# EAGLE design ArmazConnect - Rev B4 (EAGLE 7.7.0)
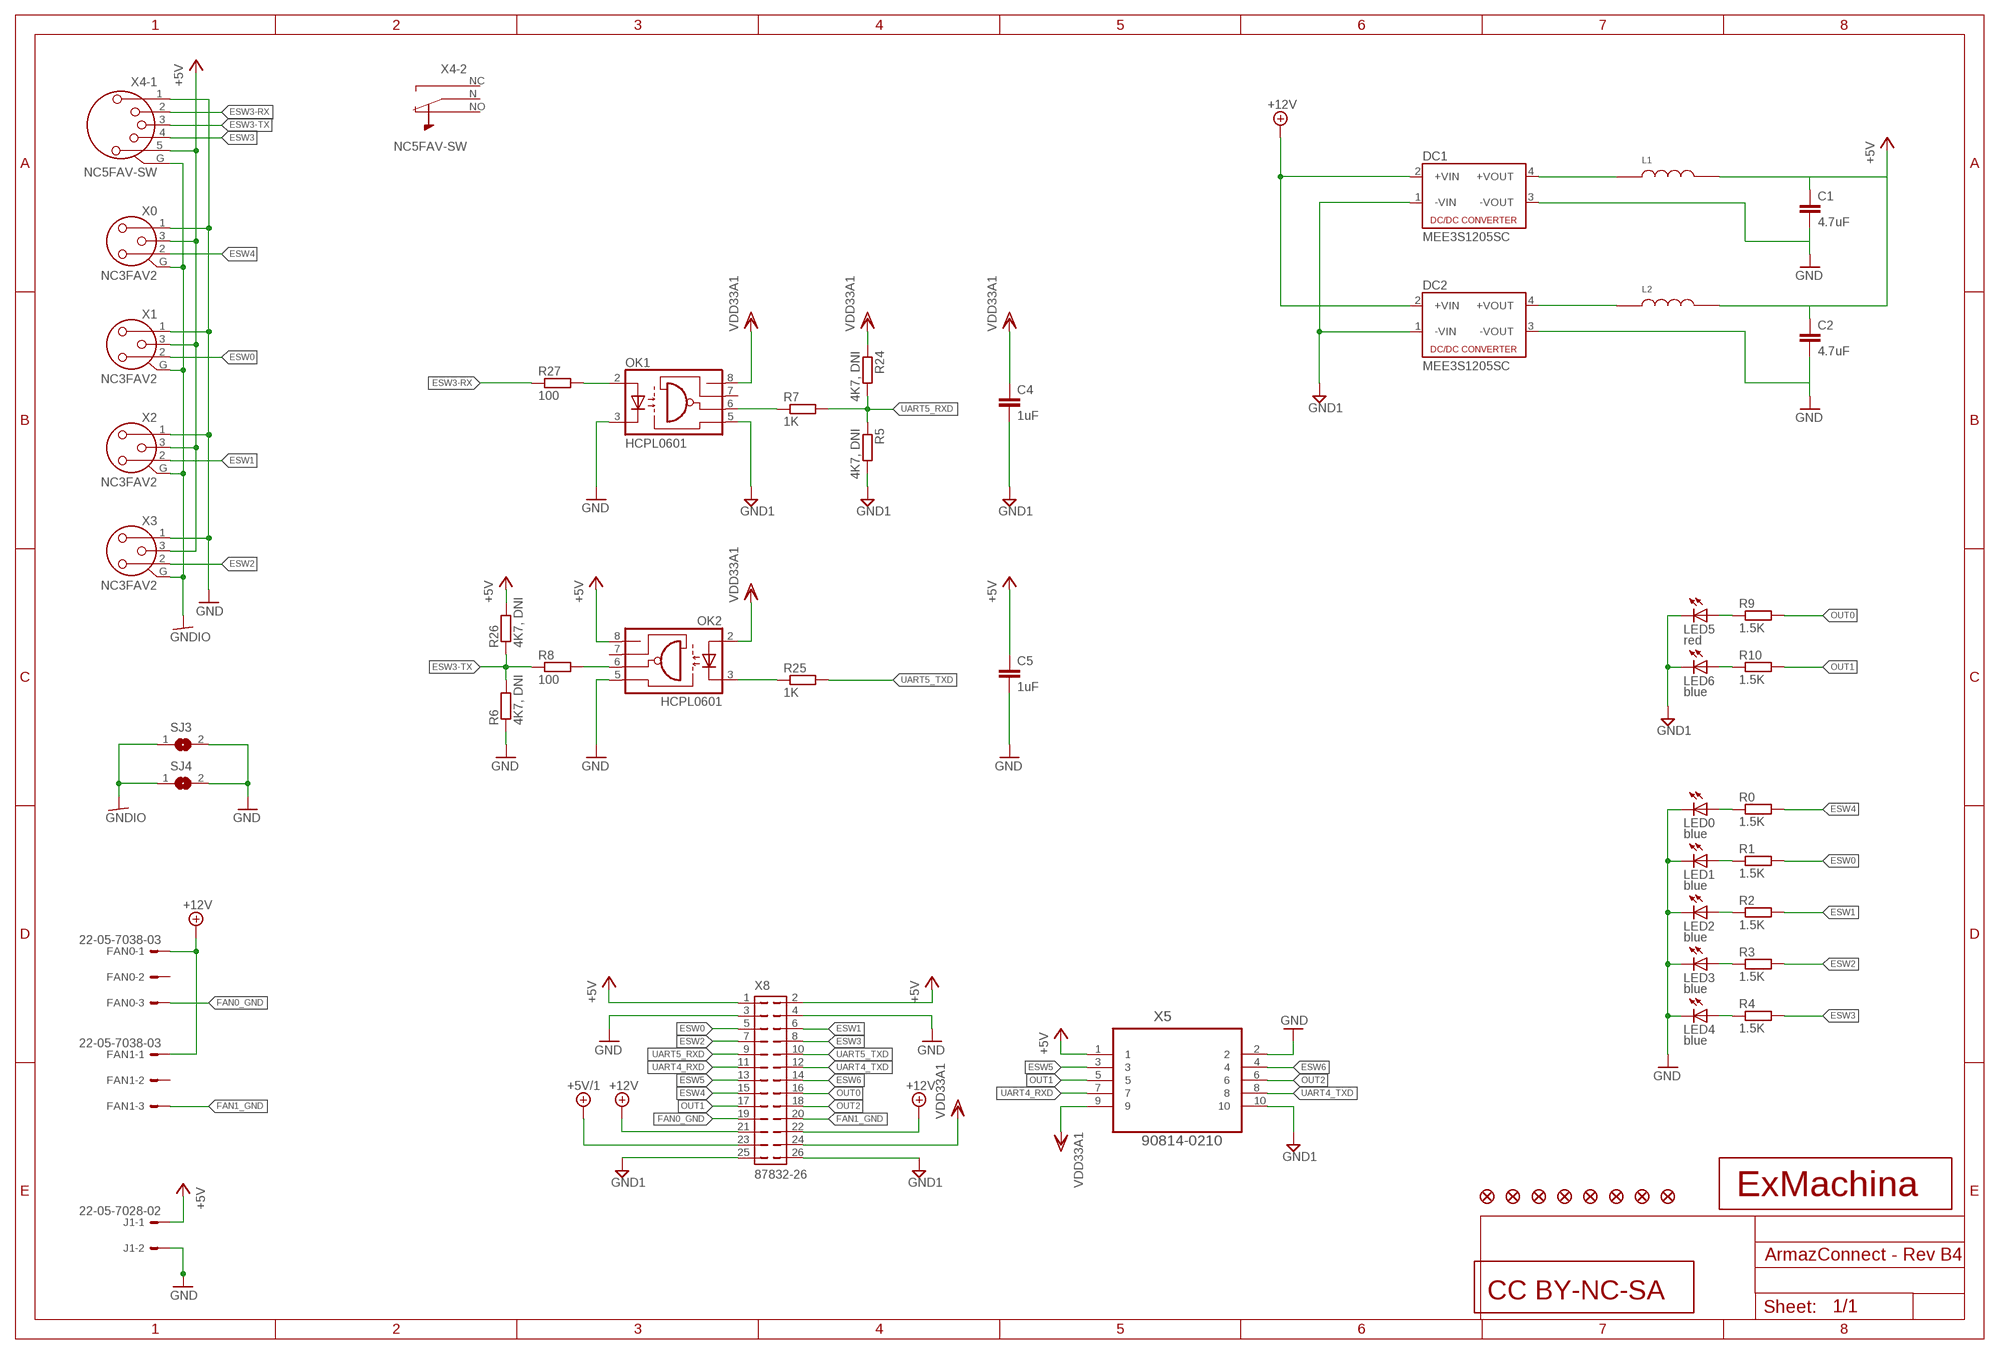
[diagram p0: schematic, sheet 1]

## Parts
C1  4.7uF  C-EUC0603  [C0603]
C2  4.7uF  C-EUC0603  [C0603]
C4  1uF  C-EUC0805  [C0805]
C5  1uF  C-EUC0805  [C0805]
CC1  CC-BY-NC-SA  [CC-BY-NC-SA]
DC1  MEE3S1205SC  [MEE3]
DC2  MEE3S1205SC  [MEE3]
FAN0  22-05-7038-03  [7395-03]
FAN1  22-05-7038-03  [7395-03]
FI1  FIDUCIAL1X2  [FIDUCIAL-1X2]
FI2  FIDUCIAL1X2  [FIDUCIAL-1X2]
FI3  FIDUCIAL1X2  [FIDUCIAL-1X2]
FI4  FIDUCIAL1X2  [FIDUCIAL-1X2]
FI5  FIDUCIAL1X2  [FIDUCIAL-1X2]
FI6  FIDUCIAL1X2  [FIDUCIAL-1X2]
FI7  FIDUCIAL1X2  [FIDUCIAL-1X2]
FI8  FIDUCIAL1X2  [FIDUCIAL-1X2]
J1  22-05-7028-02  [7395-02]
L1  84103C  [8200]
L2  84103C  [8200]
LED0  blue  LEDCHIP-LED0603  [CHIP-LED0603]
LED1  blue  LEDCHIP-LED0603  [CHIP-LED0603]
LED2  blue  LEDCHIP-LED0603  [CHIP-LED0603]
LED3  blue  LEDCHIP-LED0603  [CHIP-LED0603]
LED4  blue  LEDCHIP-LED0603  [CHIP-LED0603]
LED5  red  LEDCHIP-LED0603  [CHIP-LED0603]
LED6  blue  LEDCHIP-LED0603  [CHIP-LED0603]
OK1  HCPL0601  [SOIC08]
OK2  HCPL0601  [SOIC08]
R0  1.5K  R-EU_R0603  [R0603]
R1  1.5K  R-EU_R0603  [R0603]
R2  1.5K  R-EU_R0603  [R0603]
R3  1.5K  R-EU_R0603  [R0603]
R4  1.5K  R-EU_R0603  [R0603]
R5  4K7, DNI  R-EU_R0603  [R0603]
R6  4K7, DNI  R-EU_R0603  [R0603]
R7  1K  R-EU_R0603  [R0603]
R8  100  R-EU_R0603  [R0603]
R9  1.5K  R-EU_R0603  [R0603]
R10  1.5K  R-EU_R0603  [R0603]
R24  4K7, DNI  R-EU_R0603  [R0603]
R25  1K  R-EU_R0603  [R0603]
R26  4K7, DNI  R-EU_R0603  [R0603]
R27  100  R-EU_R0603  [R0603]
SJ3  SJ  [SJ]
SJ4  SJ  [SJ]
U$1  EXMACHINA-LOGO-NAME  [EXM-LOGO-BASELINE]
X0  NC3FAV2  [NC3FAV2]
X1  NC3FAV2  [NC3FAV2]
X2  NC3FAV2  [NC3FAV2]
X3  NC3FAV2  [NC3FAV2]
X4  NC5FAV-SW  [NC5FAV-SW]
X5  90814-0210  [MOLEX_90814-0210]
X8  87832-26  [87832-26]

## Nets
+5V [supply]: C1.1 C2.1 C5.1 J1.1 L1.2 L2.2 OK2.8(VCC) R26.2 X0.3 X1.3 X2.3 X3.3 X4.5 X5.1 X8.1 X8.2
+5V/1 [supply]: X8.23
+12V [supply]: DC1.2(+VIN) DC2.2(+VIN) FAN0.1 FAN1.1 X8.21 X8.22
ESW0: R1.2 X1.2 X8.5
ESW1: R2.2 X2.2 X8.6
ESW2: R3.2 X3.2 X8.7
ESW3: R4.2 X4.4 X8.8
ESW3-RX: R27.1 X4.2
ESW3-TX: R6.2 R8.1 R26.1 X4.3
ESW4: R0.2 X0.2 X8.15
ESW5: X5.3 X8.13
ESW6: X5.4 X8.14
FAN0_GND [supply2]: FAN0.3 X8.19
FAN1_GND [supply2]: FAN1.3 X8.20
GND [supply]: C1.2 C2.2 C5.2 DC1.3(-VOUT) DC2.3(-VOUT) J1.2 LED0.C LED1.C LED2.C LED3.C LED4.C OK1.3(C) OK2.5(GND) R6.1 SJ3.2 SJ4.2 X0.1 X1.1 X2.1 X3.1 X4.1 X5.2 X8.3 X8.4
GND1 [supply]: C4.2 DC1.1(-VIN) DC2.1(-VIN) LED5.C LED6.C OK1.5(GND) R5.2 X5.10 X8.25 X8.26
GNDIO [supply]: SJ3.1 SJ4.1 X0.G X1.G X2.G X3.G X4.G(-1:G)
N$1: LED1.A R1.1
N$2: LED2.A R2.1
N$3: LED3.A R3.1
N$4: LED4.A R4.1
N$5 [supply]: DC1.4(+VOUT) L1.1
N$6: OK1.2(A) R27.2
N$7 [supply]: DC2.4(+VOUT) L2.1
N$8: OK2.6(VO) R8.2
N$9: LED5.A R9.1
N$10: OK1.6(VO) R7.1
N$11: LED6.A R10.1
N$16: LED0.A R0.1
N$17: OK2.3(C) R25.1
OUT0: R9.2 X8.16
OUT1: R10.2 X5.5 X8.17
OUT2: X5.6 X8.18
UART4_RXD: X5.7 X8.11
UART4_TXD: X5.8 X8.12
UART5_RXD: R5.1 R7.2 R24.2 X8.9
UART5_TXD: R25.2 X8.10
VDD33A1 [supply2]: C4.1 OK1.8(VCC) OK2.2(A) R24.1 X5.9 X8.24
Unconnected: FAN0.2 FAN1.2 OK1.7(VE) OK2.7(VE) X4.N(-2:N) X4.NC(-2:NC) X4.NO(-2:NO)

## Library data of the parts
C1 C2 = rcl:C-EU: CAPACITOR, European symbol; MF: MULTICOMP; MPN: MC0603X475K6R3CT; OC_FARNELL: 2320811
C4 C5 = rcl:C-EU: CAPACITOR, European symbol; MF: MULTICOMP; MPN: MC0805F105Z500CT; OC_FARNELL: 1759432
CC1 = cc-by-sa:CC-BY-NC-SA
DC1 DC2 = dc-dc-converter:MEE3; MF: MURATA POWER SOLUTIONS; MPN: MEE3S1205SC; OC_FARNELL: 2083742
FAN0 FAN1 = con-molex:22-?-03: CONNECTOR wire to board 2.54 mm (.1 inch) pitch header; MF: MOLEX; MPN: 22-05-7038; OC_FARNELL: 9731610; OC_NEWARK: unknown
FI1-FI8 = SparkFun:FIDUCIAL: Fiducial Alignment Points Various fiducial points for machine vision alignment.; OC_FARNELL: unknown
J1 = con-molex:22-?-02: CONNECTOR wire to board 2.54 mm (.1 inch) pitch header; OC_FARNELL: 9731601; OC_NEWARK: unknown
L1 L2 = murata-inductance:84103C: WARNING : 8200 WRONG FOOTPRINT 8400 GOOD FOOTPRINT; MF: WURTH ELEKTRONIK; MPN: 744045100; OC_FARNELL: 1800409
LED0 LED1-LED6 = led:LED: LED OSRAM: - CHIPLED LG R971, LG N971, LY N971, LG Q971, LY Q971, LO R971, LY R971 LH N974, LH R974 LS Q976, LO Q976, LY Q976 LO Q996 - Hyper CHIPLED LW Q18S LB Q993, LB Q99A, LB R99A - SideLED LS A670, LO A670, LY A670, LG A670, LP A670 LB A673, LV A673, LT A673, LW A673 LH A674 LY A675 LS A676, LA A676, LO A676, LY A676, LW A676 LS A679, LY A679, LG A679 - Hyper Micro SIDELED® LS Y876, LA Y876, LO Y876, LY Y876 LT Y87S - SmartLED LW L88C, LW L88S LB L89C, LB L89S, LG L890 LS L89K, LO L89K, LY L89K LS L896, LA L896, LO L896, LY L896 - TOPLED LS T670, LO T670, LY T670, LG T670, LP T670 LSG T670, LSP T670, LSY T670, LOP T670, LYG T670 LG T671, LOG T671, LSG T671 LB T673, LV T673, LT T673, LW T673 LH T674 LS T676, LA T676, LO T676, LY T676, LB T676, LH T676, LSB T676, LW T676 LB T67C, LV T67C, LT T67C, LS T67K, LO T67K, LY T67K, LW E67C LS E67B, LA E67B, LO E67B, LY E67B, LB E67C, LV E67C, LT E67C LW T67C LS T679, LY T679, LG T679 LS T770, LO T770, LY T770, LG T770, LP T770 LB T773, LV T773, LT T773, LW T773 LH T774 LS E675, LA E675, LY E675, LS T675 LS T776, LA T776, LO T776, LY T776, LB T776 LHGB T686 LT T68C, LB T68C - Hyper Mini TOPLED® LB M676 - Mini TOPLED Santana® LG M470 LS M47K, LO M47K, LY M47K Source: http://www.osram.convergy.de LUXEON: - LUMILED® LXK2-PW12-R00, LXK2-PW12-S00, LXK2-PW14-U00, LXK2-PW14-V00 LXK2-PM12-R00, LXK2-PM12-S00, LXK2-PM14-U00 LXK2-PE12-Q00, LXK2-PE12-R00, LXK2-PE12-S00, LXK2-PE14-T00, LXK2-PE14-U00 LXK2-PB12-K00, LXK2-PB12-L00, LXK2-PB12-M00, LXK2-PB14-N00, LXK2-PB14-P00, LXK2-PB14-Q00 LXK2-PR12-L00, LXK2-PR12-M00, LXK2-PR14-Q00, LXK2-PR14-R00 LXK2-PD12-Q00, LXK2-PD12-R00, LXK2-PD12-S00 LXK2-PH12-R00, LXK2-PH12-S00 LXK2-PL12-P00, LXK2-PL12-Q00, LXK2-PL12-R00 Source: www.luxeon.com KINGBRIGHT: KA-3528ASYC Source: www.kingbright.com; MF: MULTICOMP; MPN: OVS-0603; OC_FARNELL: 1716770
OK1 OK2 = optocoupler:HCPL0601: HEWLETT PACKARD OPTO COUPLER; MF: AVAGO TECHNOLOGIES; MPN: HCPL-0601-000E; OC_FARNELL: 9995102; OC_NEWARK: 88H7776
R0 R1-R4 R9 R10 = rcl:R-EU_: RESISTOR, European symbol; MF: MULTICOMP; MPN: MCMR06X1501FTL; OC_FARNELL: 2073391
R5 R6 R24 R26 = rcl:R-EU_: RESISTOR, European symbol; MF: MULTICOMP; MPN: MCMR04X3301FTL; OC_FARNELL: 2072928
R7 R25 = rcl:R-EU_: RESISTOR, European symbol; MF: MULTICOMP; MPN: MCMR06X3300FTL; OC_FARNELL: 2073472
R8 R27 = rcl:R-EU_: RESISTOR, European symbol; MF: MULTICOMP; MPN: MCMR06X4701FTL; OC_FARNELL: 2073509
SJ3 SJ4 = jumper:SJ: SMD solder JUMPER; OC_FARNELL: unknown
U$1 = exmachina:EXMACHINA-LOGO; OC_FARNELL: unknown
X0 X1-X3 = con-neutrik_ag:NC3: Neutrik Audio Connector XLR SERIES Stereo 1/4" jack Source: www.neutrik.com/; MF: NEUTRIK; MPN: NC3FAAV2; OC_FARNELL: 1310038; OC_NEWARK: 83F7211
X4 = con-neutrik_ag:NC5?-SW: Neutrik Audio Connector XLR SERIES Stereo 1/4" jack Source: www.neutrik.com/; MF: NEUTRIK; MPN: NC5FAV-SW; OC_FARNELL: 1310093
X5 = Molex_By_element14_Batch_1:90814-0210: CONN HEADER 10POS 1.27MM SMD TIN; MPN: 90814-0210; OC_FARNELL: 1757026; OC_NEWARK: 34R6217; PACKAGE: CONN-10POS; SUPPLIER: Molex
X8 = con-molex:87832-26: Milli-Grid Header 2.00mm (.079") Pitch; MF: MOLEX; MPN: 87832-2620; OC_FARNELL: 2313712; OC_NEWARK: unknown

## Net classes
0 default: width 0.203 mm, drill 0.25 mm, clearance 0.205 mm
1 supply: width 0.406 mm, drill 0.4 mm, clearance 0.205 mm to class 0, clearance 0.205 mm
2 supply2: width 0.406 mm, drill 0.35 mm, clearance 0.205 mm to class 0, clearance 0.205 mm to class 1, clearance 0.205 mm

## Board
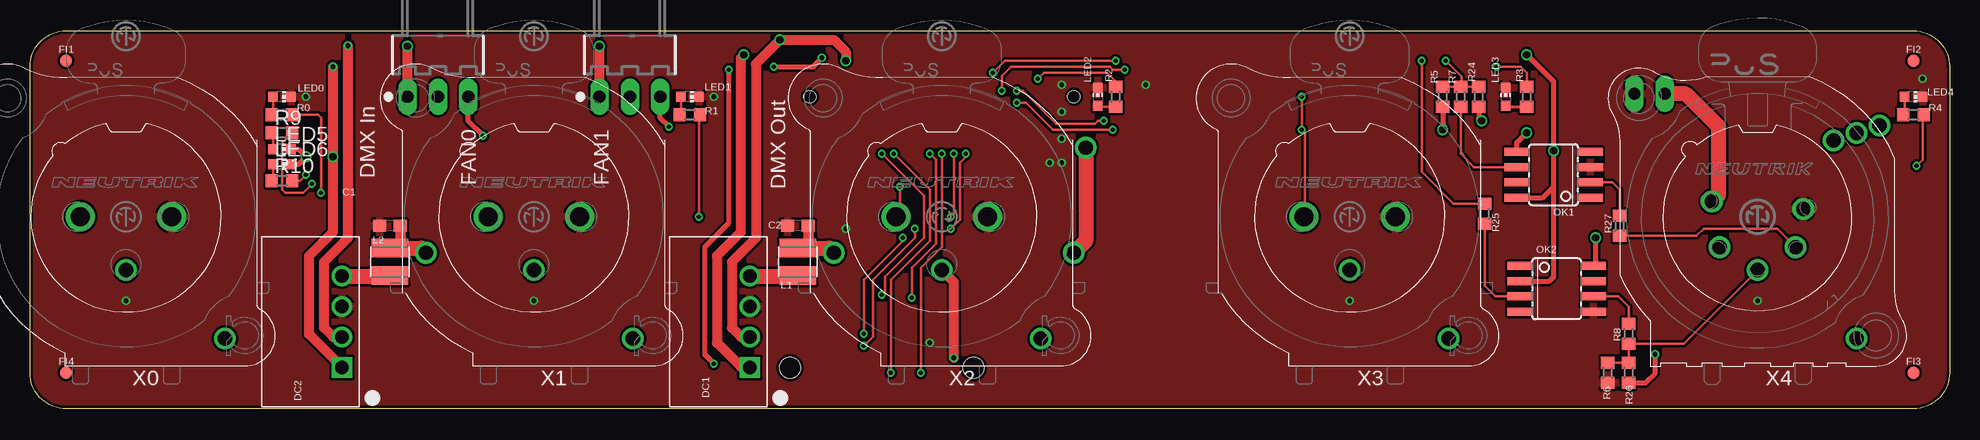
[diagram p1: board, top side]
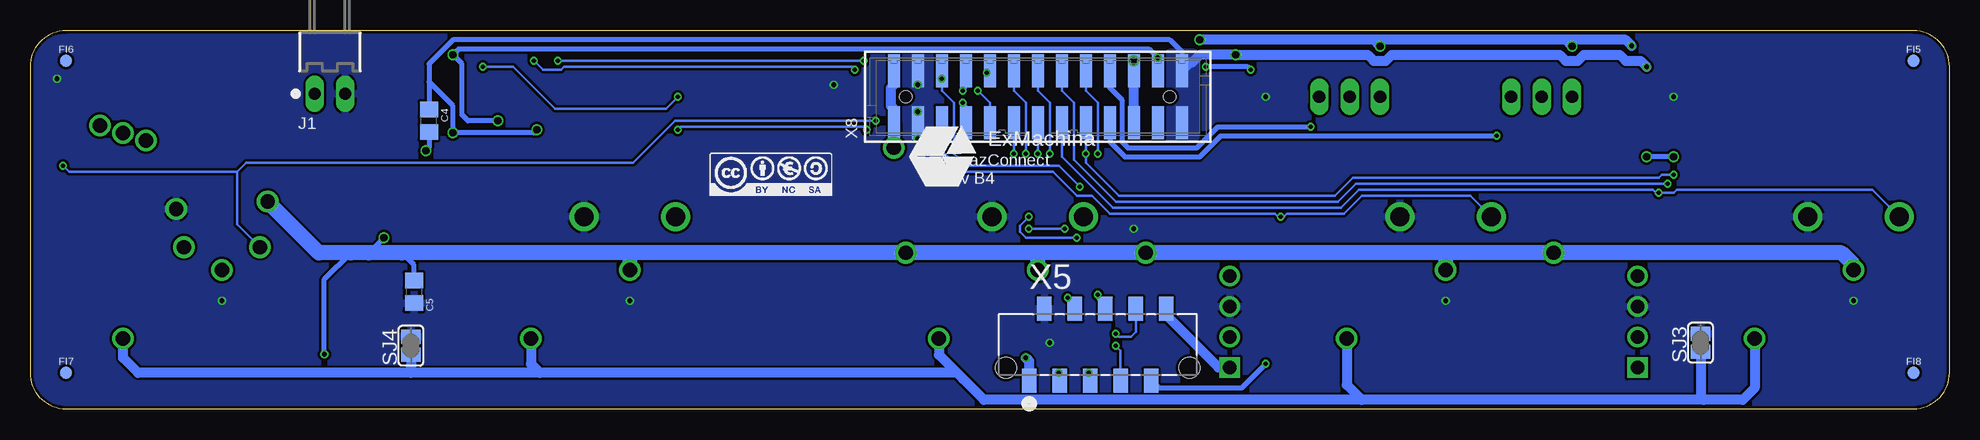
[diagram p2: board, bottom side, seen from below]

Size 160 x 31.5 mm. Coordinates in mm from the lower left corner, seen from the top.
Outline: 157,0 3,0 arc-90 0,3 0,28.5 arc-90 3,31.5 157,31.5 arc-90 160,28.5 160,3 arc-90 157,0
Copper layers (1*16): Top 0.018mm / dielectric 1.55mm / Bottom 0.018mm
Design rules "eC_2Layer_PClass5_BaseCopperO18 *": minimum track width 0.175mm, minimum drill 0.35mm, track to track 0.175mm, track to pad 0.175mm, pad to pad 0.175mm, via to via 0.175mm, smd to smd 0mil, copper to edge 0.25mm, drill to drill 0.35mm, minimum pad ring 0.2mm, minimum via ring 0.15mm, stop-mask expansion 0mil, vias tented up to drill 0.45mm, thermal gap 0.2mm

### Footprints (pad centres in the part's own frame; a part is rotated, then mirrored left to right if it is on the bottom)
C0603 = smd 1.1 x 1: 1 -0.85,0; 2 0.85,0
C0805 = smd 1.3 x 1.5: 1 -0.95,0; 2 0.95,0
MEE3 = drill 1.15 square: 1 -3.81,0 | drill 1.15: 2 -1.27,0; 3 1.27,0; 4 3.81,0
7395-03 = drill 1.016 long: 1 2.54,0; 2 0,0; 3 -2.54,0
FIDUCIAL-1X2 = smd 1 x 1: 1 0,0
7395-02 = drill 1.016 long: 1 1.27,0; 2 -1.27,0
8200 = smd 3.05 x 1.52: 1 0,1.145; 2 0,-1.145
CHIP-LED0603 = smd 0.8 x 0.8: A 0,-0.75; C 0,0.75
SOIC08 = smd 0.66 x 2.032: 1 -1.905,-3.073; 2 -0.635,-3.073; 3 0.635,-3.073; 4 1.905,-3.073; 5 1.905,3.073; 6 0.635,3.073; 7 -0.635,3.073; 8 -1.905,3.073
R0603 = smd 1 x 1.1: 1 -0.85,0; 2 0.85,0
SJ = smd 1.168 x 1.6: 1 -0.762,0; 2 0.762,0
NC3FAV2 = drill 1.6: 1 3.81,0; 2 -3.81,0 | drill 1.2: 3 0,-4.45; G 8.25,-10.16
NC5FAV-SW = drill 1.2: 1 3.81,0.635; 2 3.175,-2.54; 3 0,-4.445; 4 -3.175,-2.54; 5 -3.81,1.27; G 8.255,-10.16; N 8.255,6.985; NC 6.35,6.35; NO 10.16,7.62
MOLEX_90814-0210 = smd 1.194 x 2.007: 1 -5.715,-3.175; 2 -4.445,2.819; 3 -3.175,-3.175; 4 -1.905,2.819; 5 -0.635,-3.175; 6 0.635,2.819; 7 1.905,-3.175; 8 3.175,2.819; 9 4.445,-3.175; 10 5.715,2.819 | hole 1.753: -7.645,-2.083; 7.645,-2.083
87832-26 = smd 1 x 2.75: 1 -12,-2.15; 2 -12,2.15; 3 -10,-2.15; 4 -10,2.15; 5 -8,-2.15; 6 -8,2.15; 7 -6,-2.15; 8 -6,2.15; 9 -4,-2.15; 10 -4,2.15; 11 -2,-2.15; 12 -2,2.15; 13 0,-2.15; 14 0,2.15; 15 2,-2.15; 16 2,2.15; 17 4,-2.15; 18 4,2.15; 19 6,-2.15; 20 6,2.15; 21 8,-2.15; 22 8,2.15; 23 10,-2.15; 24 10,2.15; 25 12,-2.15; 26 12,2.15 | hole 1: -11,0; 11,0

### Placement (x,y rotation side)
C1  30,15.25 180 top
C2  64,15.25 180 top
C4  126.75,24 90 bottom
C5  128,9.75 270 bottom
CC1  98.25,19.5 0 bottom
DC1  60,7.25 90 top
DC2  26,7.25 90 top
FAN0  34,26 180 top
FAN1  50,26 180 top
FI1  3,29 0 top
FI2  157,29 0 top
FI3  157,3 0 top
FI4  3,3 0 top
FI5  3,29 0 bottom
FI6  157,29 0 bottom
FI7  157,3 0 bottom
FI8  3,3 0 bottom
J1  135,26.25 180 bottom
L1  64,12.25 180 top
L2  30,12.25 180 top
LED0  21,26 270 top
LED1  55,26 270 top
LED2  89,26 0 top
LED3  123,26 0 top
LED4  157,26 270 top
LED5  21,21.62 270 top
LED6  21,20.38 270 top
OK1  127,19.5 90 top
OK2  127.25,10 270 top
R0  21,24.5 0 top
R1  55,24.5 0 top
R2  90.5,26 90 top
R3  124.75,26 90 top
R4  157,24.5 0 top
R5  117.75,26 270 top
R6  131.5,3 90 top
R7  119.25,26 90 top
R8  133.25,6.25 90 top
R9  21,23 0 top
R10  21,19 0 top
R24  120.75,26 90 top
R25  121.25,16.25 90 top
R26  133.25,3 270 top
R27  132.5,15.25 90 top
SJ3  20.75,5.5 90 bottom
SJ4  128.25,5.25 90 bottom
U$1  84,21 0 bottom
X0  8,16 0 top
X1  42,16 0 top
X2  76,16 0 top
X3  110,16 0 top
X4  144,16 0 top
X5  71,5.5 0 bottom
X8  76,26 0 bottom

### Tracks (layer width: path | path; a pad name or v marks a point on that pad's centre or on a via)
+5V  (via drill 0.4, 0.6, 1.2)
  Top 0.406: OK2.8 130.5,12.08 v130.5,14.25 | R26.2 134.65,2.15 135.46,2.96 v135.46,4.54
  Top 0.813: v77,4.25 77,10.55 X2.3 | C2.1 64.85,13.74 64.5,13.39 | C1.1 30.85,13.85 30.75,13.75 30.75,13.64 31,13.39
  Top 1.27: v88,21.75 88,14 v87,13 | L1.2 64.5,13.39 66.61,13.39 v67,13 | L2.2 31,13.39 32.6,13.39 v33,13 | X4.5 140.75,17.83 140.75,23.5 138,26.25 J1.1
  Bottom 0.406: v130.5,14.25 131.75,13 | v135.46,4.54 135.46,10.79 133.25,13 | C5.1 128,12 129,13
  Bottom 0.813: v77,4.25 76.72,3.96 X5.1 | X8.1 88,25 88.25,25.25 88.25,26.75 88,27 X8.2
  Bottom 1.016: X8.1 v88,21.75
  Bottom 1.27: X0.3 8,12 9,13 v33,13 42,13 | 42,13 v67,13 76,13 | X4.5 135.92,13 133.25,13 131.75,13 129,13 110,13 | 75.95,11.5 X2.3 76,13 | X1.3 42,13 | 76,13 v87,13 110,13 | X3.3 110,13
+12V  (via drill 0.4, 0.6)
  Top 0.813: DC1.2 59.98,6 59.25,6 58.5,6.75 58.5,12.25 60.5,14.25 60.5,28.75 v62.5,30.75 67,30.75 68,29.75 v68,29 | FAN0.1 v31.46,30.21 | FAN1.1 v47.46,30.21 | DC2.2 25.27,5.98 24.5,6.75 24.5,12.25 26.5,14.25 v26.5,30.25
  Bottom 0.813: X8.21 X8.22 | v31.46,30.21 32,30.75 | 32,30.75 48,30.75 | 48,30.75 v62.5,30.75 | v47.46,30.21 48,30.75 | 68,28.25 X8.22 | v68,29 X8.22 | v26.5,30.25 27,30.75 32,30.75
ESW0  (via drill 0.35)
  Top 0.203: v55.75,16 55.75,24.4 R1.2
  Bottom 0.203: X8.5 84,21.5 82.25,19.75 74.75,19.75 72.75,17.75 71.5,17.75 70,16.25 56.25,16.25 56,16 v55.75,16 55.5,16 55.25,16.25 50.5,16.25 49,17.75 39.94,17.75 X1.2
ESW1  (via drill 0.35)
  Top 0.203: X2.2 72.5,16.31 v72.5,18.5 | R2.2 90.5,27.25 89.75,28 84.5,28 v84,27.5
  Bottom 0.203: X8.6 v84,27.5 84,26.5 83,25.5 83,21.25 82,20.25 74.25,20.25 v72.5,18.5
ESW2  (via drill 0.35)
  Top 0.203: X3.2 106.25,16.06 106.25,23 v106,23.25 v106,26 | v82.25,25.5 83,25.5 85.25,23.25 v90.25,23.25 | v122.25,28.5 124.25,28.5 124.75,28 R3.2
  Bottom 0.203: v90.25,23.25 90.5,23.5 105.75,23.5 v106,23.25 | X8.7 82,25.25 v82.25,25.5 | v106,26 107,25 116.25,25 119.75,28.5 v122.25,28.5
ESW3  (via drill 0.35)
  Top 0.203: v89.5,24 89,24 88.75,23.75 85.5,23.75 82.75,26.5 v82.25,26.5 | v157.25,20.25 157.75,20.75 157.75,24 157.85,24.1 R4.2
  Bottom 0.203: v89.5,24 106.25,24 109.75,20.5 142,20.5 142.75,19.75 | 142.75,19.75 142.75,15.38 X4.4 | X8.8 82,26.75 v82.25,26.5 | 142.75,19.75 156.75,19.75 v157.25,20.25
ESW3-RX
  Top 0.203: R27.1 138.9,14.4 139.5,15 145.63,15 X4.2
ESW3-TX
  Top 0.203: R6.2 R26.1 R8.1 137.84,5.4 X4.3
ESW4  (via drill 0.35)
  Top 0.203: v24.25,18 24.25,24.25 24,24.5 R0.2
  Bottom 0.203: X0.2 6.44,18.25 22.75,18.25 23,18 v24.25,18 24.5,18 24.75,18.25 49.25,18.25 50.75,16.75 69.75,16.75 74,21 X8.15
ESW5  (via drill 0.35)
  Top 0.203: v76,21.25 76,13.5 74.25,11.75 v74.25,3
  Bottom 0.203: X8.13 v76,21.25 | v74.25,3 74.25,2.55 X5.3
ESW6  (via drill 0.35)
  Top 0.203: v75,21.25 75.5,20.75 75.5,13.75 73.5,11.75 v73.5,9.25
  Bottom 0.203: X8.14 76,26.5 75,25.5 v75,21.25 | v73.5,9.25 73.5,9.07 X5.4
FAN0_GND  (via drill 0.35)
  Top 0.406: v37.75,22.75 36.54,23.96 FAN0.3
  Bottom 0.406: X8.19 70,22.25 68.75,21 62.5,21 60.75,22.75 v37.75,22.75
FAN1_GND  (via drill 0.35)
  Top 0.406: v53.25,23.5 52.54,24.21 FAN1.3
  Bottom 0.406: 70,28 X8.20 70,26.75 69,25.75 69,22.25 68.5,21.75 62.75,21.75 61,23.5 v53.25,23.5
GND  (via drill 0.4)
  other vias: 42,9 75,5.5 110,9 144,9 8,9 86,22.5 86,27 93,27 68,15 86,24.75 86,20.5 85,20.5 23,26 57,26 157.75,27.5
  pour Bottom (rank 6): -7,-4 163,-4 163,34 -7,34
  pour Top (rank 6): -6,-3 162,-3 162,33 -6,33
  pour Bottom (rank 6, no thermals): 85,29.75 87,29.75 87,22.25 85,22.25
GND1  (via drill 0.4, 0.6)
  Top 0.406: OK1.5 123.93,22.18 v124.75,23 | LED6.C 22.38,20.38 v23,21 22.38,21.62 LED5.C | R5.2 v117.75,23.25
  Top 0.813: DC1.1 59.31,3.44 57.25,5.5 57.25,12.75 59.25,14.75 59.25,29.25 v59.5,29.5 | DC2.1 23.25,6.19 23.25,12.75 25.25,14.75 v25.25,21 v25.25,28.5
  Bottom 0.406: X8.26 64,29.75 65,30.75 124.75,30.75 126.75,28.75 126.75,27.25 | 126.75,27.25 C4.2 | v23,21 v25.25,21 | v117.75,23.25 118,23 v124.75,23 124.75,25.25 126.75,27.25
  Bottom 0.813: X8.26 63.27,28.88 63.12,28.88 62.5,29.5 v59.5,29.5 48.5,29.5 48,29 47,29 46.5,29.5 32.5,29.5 32,29 31,29 30.5,29.5 27.5,29.5 27,29 25.75,29 v25.25,28.5 | DC1.1 60.94,3.44 65.28,7.79 X5.10
  pour Bottom (no thermals): 65,29.5 65,22.5 63,22.5 63,29.5
GNDIO
  Bottom 0.406: 128.25,3.5 128.25,3
  Bottom 0.813: X0.G 16.25,1.75 17.25,0.75 20.5,0.75 | 20.5,0.75 49,0.75 | 49,0.75 80.5,0.75 82.25,2.5 82.75,3 | 82.75,3 117.5,3 | 117.5,3 128.25,3 151,3 152.25,4.25 X4.G | SJ4.1 128.25,3.5 | X3.G 118.25,3.75 117.5,3 | X1.G 50.25,2 49,0.75 | SJ3.1 20.75,1 20.5,0.75 | X2.G 84.25,4.5 82.75,3
N$1
  Top 0.203: R1.1 54.25,24.5 LED1.A
N$2
  Top 0.203: R2.1 89.1,25.15 LED2.A
N$3
  Top 0.254: LED3.A 123.1,25.15 R3.1
N$4
  Top 0.203: R4.1 arc45 156.25,24.74 LED4.A
N$5
  Top 0.813: 63.95,11.06 L1.1
  Top 1.27: DC1.4 63.95,11.06
N$6
  Top 0.203: OK1.2 131.88,18.86 132.5,18.25 R27.2
N$7
  Top 1.27: DC2.4 29.95,11.06 L2.1
N$8
  Top 0.203: OK2.6 132.38,9.37 133.25,8.5 R8.2
N$9
  Top 0.203: R9.1 20.25,22.9 LED5.A
N$10
  Top 0.203: OK1.6 120.36,20.14 119.25,21.25 R7.1
N$11
  Top 0.203: R10.1 20.25,19.1 LED6.A
N$16
  Top 0.203: R0.1 20.25,24.6 LED0.A
N$17
  Top 0.203: R25.1 121.25,10.25 122.14,9.37 OK2.3
OUT0  (via drill 0.35)
  Top 0.203: v23.5,18.75 22.75,18 21.25,18 21,18.25 21,22.15 R9.2
  Bottom 0.203: X8.16 74,26.5 73,25.5 73,20.75 69.5,17.25 51,17.25 49.5,18.75 v23.5,18.75
OUT1  (via drill 0.35)
  Top 0.203: v71.75,3 71.75,10.75 75,14 75,18.25 v72,21.25 | v23,19.5 22.5,19 R10.2
  Bottom 0.203: X8.17 v72,21.25 72,20.5 69.25,17.75 51.25,17.75 49.75,19.25 24.25,19.25 24,19.5 v23,19.5 | X5.5 71.64,2.88 v71.75,3
OUT2  (via drill 0.35)
  Top 0.203: v71,9.5 71.25,9.75 71.25,11 74.5,14.25 74.5,17.75 v71,21.25
  Bottom 0.203: X8.18 72,26.5 71,25.5 v71,21.25 | X5.6 71,9.11 v71,9.5
UART4_RXD  (via drill 0.35)
  Top 0.203: v78,21.25 78,21 77.5,20.5 77.5,15.75 v76.75,15 | v73.75,15 73.75,14.25 70.25,10.75 70.25,6 v69.5,5.25
  Bottom 0.203: X8.11 v78,21.25 | v76.75,15 v73.75,15 | X5.7 69.09,4.84 v69.5,5.25
UART4_TXD  (via drill 0.35)
  Top 0.203: v69.5,6.25 69.5,10.75 72.75,14 v72.75,14.25 | v77,21.25 77,16.25 v76.75,16
  Bottom 0.203: X8.12 78,26.5 77,25.5 v77,21.25 | v76.75,16 77.5,15.25 77.5,14.75 77,14.25 v72.75,14.25 | X5.8 67.83,6.42 68.25,6 69.25,6 v69.5,6.25
UART5_RXD  (via drill 0.35)
  Top 0.203: v81,26.5 81,27.75 81.75,28.5 90,28.5 90.25,28.25 v91.25,28.25 | 119.3,26.9 119.3,27.7 v118,29 | R5.1 R7.2 R24.2
  Top 0.254: R7.2 119.3,26.9
  Bottom 0.203: X8.9 80,25.5 v81,26.5 | v91.25,28.25 91.5,28.5 115.5,28.5 115.75,28.25 117.25,28.25 v118,29
UART5_TXD  (via drill 0.35)
  Top 0.203: v80.25,28 81.25,29 v90.5,29 | v116,29 116,19.75 118.65,17.1 R25.2
  Bottom 0.203: X8.10 80.15,28 v80.25,28 | v90.5,29 v116,29
VDD33A1  (via drill 0.35, 0.4, 0.6)
  Top 0.406: v57,3.75 56.25,4.5 56.25,13.5 58.25,15.5 v58.25,28.25 | v62,28.5 65.25,28.5 v66,29.25 | OK2.2 126.64,10.63 127,11 127,18.5 | 127,18.5 v127,21.5 127,27.25 v124.75,29.5 | OK1.8 126.09,17.59 127,18.5 | R24.1 120.75,24.25 v121,24
  Bottom 0.406: X8.24 v66,29.25 66.75,30 124.25,30 v124.75,29.5 124,28.75 124,24.5 123.5,24 v121,24 | X5.9 65.83,1.75 59,1.75 v57,3.75 | v58.25,28.25 58.5,28.5 v62,28.5 | C4.1 126.75,21.75 v127,21.5

### Text on the board
bPlace: ArmazConnect / Rev B4
tNames: DMX In | DMX Out
Measures: ESW2 | DRV EN | ESW0 | ESW1 | ESW3 | DMX0-IN | DMX0-OUT | ETH0-0